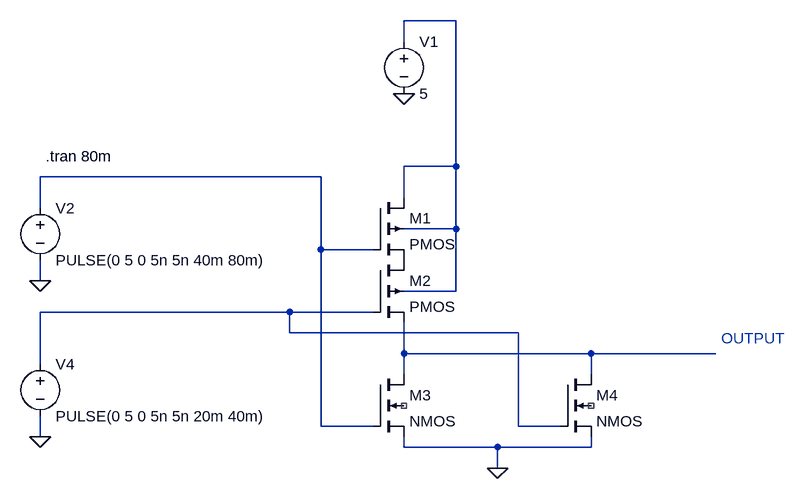
[diagram p0: schematic nor-gate-ltspice.asc]
nor-gate-ltspice.asc, the LTspice schematic file:
Version 4
SHEET 1 1044 680
WIRE 544 -48 464 -48
WIRE 464 -16 464 -48
WIRE 544 176 544 -48
WIRE 544 176 464 176
WIRE 336 192 -96 192
WIRE 464 224 464 176
WIRE -96 240 -96 192
WIRE 544 272 544 176
WIRE 544 272 464 272
WIRE 336 304 336 192
WIRE 416 304 336 304
WIRE -96 352 -96 320
WIRE 544 368 544 272
WIRE 544 368 464 368
WIRE 288 400 -96 400
WIRE 416 400 288 400
WIRE 288 432 288 400
WIRE 640 432 288 432
WIRE 464 464 464 416
WIRE 752 464 464 464
WIRE 944 464 752 464
WIRE -96 480 -96 400
WIRE 464 496 464 464
WIRE 752 496 752 464
WIRE 336 576 336 304
WIRE 416 576 336 576
WIRE 640 576 640 432
WIRE 704 576 640 576
WIRE -96 592 -96 560
WIRE 464 608 464 592
WIRE 608 608 464 608
WIRE 752 608 752 592
WIRE 752 608 608 608
WIRE 608 640 608 608
FLAG -96 352 0
FLAG 464 64 0
FLAG 608 640 0
FLAG -96 592 0
SYMBOL voltage 464 -32 R0
SYMATTR InstName V1
SYMATTR Value 5
SYMBOL Voltage -96 224 R0
SYMATTR InstName V2
SYMATTR Value PULSE(0 5 0 5n 5n 40m 80m)
SYMBOL Voltage -96 464 R0
SYMATTR InstName V4
SYMATTR Value PULSE(0 5 0 5n 5n 20m 40m)
SYMBOL nmos4 416 496 R0
SYMATTR InstName M3
SYMBOL nmos4 704 496 R0
SYMATTR InstName M4
SYMBOL pmos4 416 224 R0
SYMATTR InstName M1
SYMBOL pmos4 416 320 R0
SYMATTR InstName M2
TEXT 952 440 Left 2 ;OUTPUT
TEXT -88 160 Left 2 !.tran 80m

The netlist it stands for:
* nor-gate-ltspice.asc
V1 N001 0 5
V2 N002 0 PULSE(0 5 0 5n 5n 40m 80m)
V4 N003 0 PULSE(0 5 0 5n 5n 20m 40m)
M3 N004 N002 0 NC_01 NMOS
M4 N004 N003 0 NC_02 NMOS
M1 N001 N002 P001 N001 PMOS
M2 P001 N003 N004 N001 PMOS
.model NMOS NMOS
.model PMOS PMOS
.lib standard.mos
* OUTPUT
.tran 80m
.backanno
.end